# Altium schematic sheet DSG_Card_TopLevel.SchDoc
size B; Organization: Mechanart, LLC; Address1: 397 Laurie Meadows Drive; Address2: Apt. 437; Address3: San Mateo, CA 94403
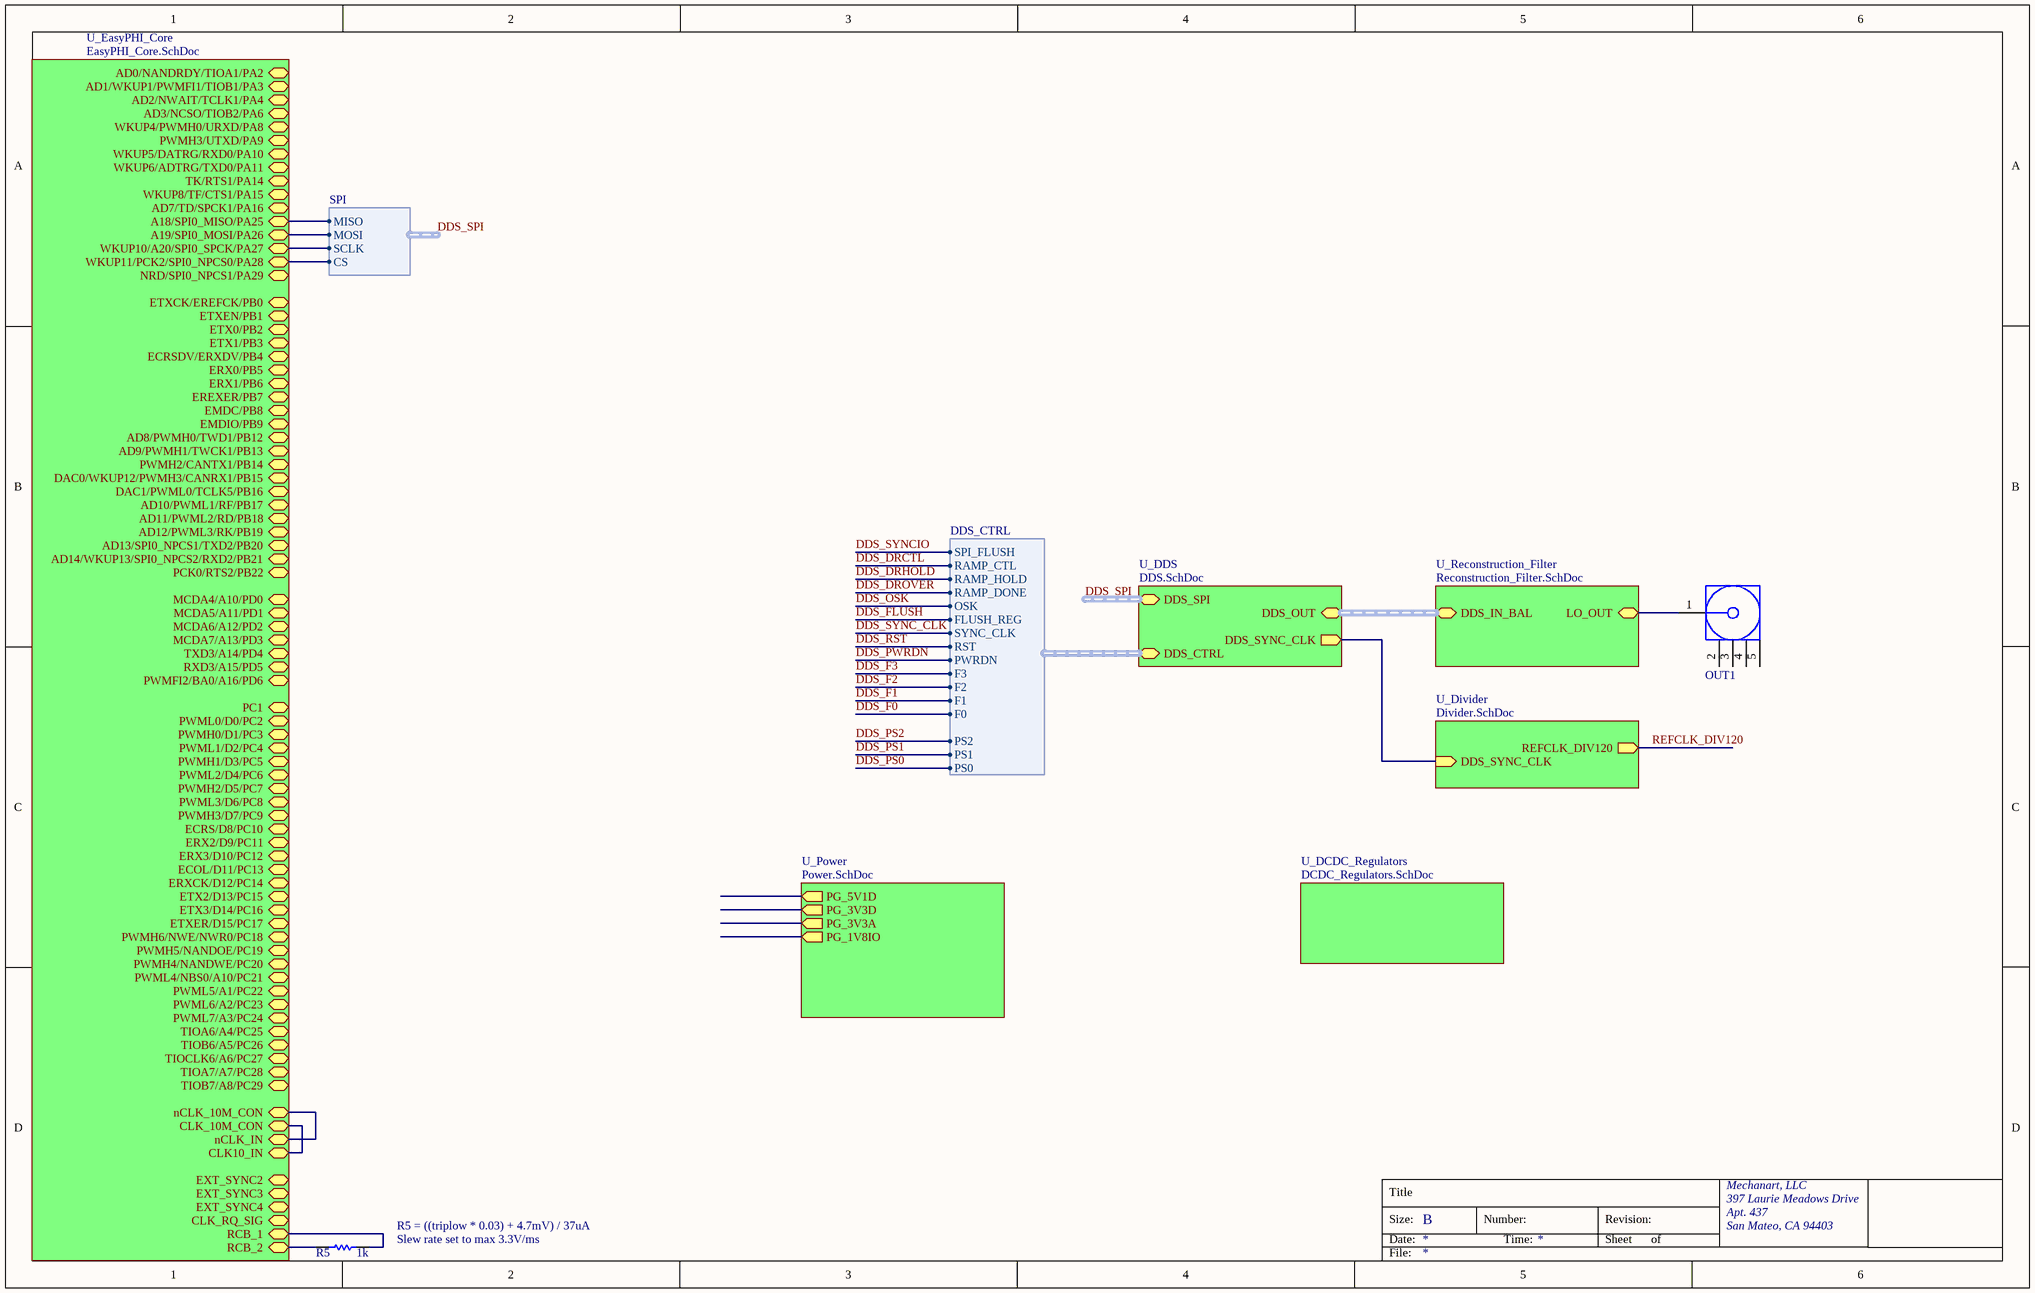
[diagram p0: DSG_Card_TopLevel.SchDoc]

## Parts
OUT1  SMA  [EMERSON_EDGE_062]  (value not drawn)
R5  1k  [RESC1608X45L30N]

## Sub-sheets
U_DCDC_Regulators = DCDC_Regulators.SchDoc: no entries
U_DDS = DDS.SchDoc: DDS_OUT (harness RF_BAL), DDS_CTRL (harness DDS_CTRL), DDS_SPI (harness SPI), DDS_SYNC_CLK (out)
U_Divider = Divider.SchDoc: REFCLK_DIV120 (out), DDS_SYNC_CLK (in)
U_EasyPHI_Core = EasyPHI_Core.SchDoc: AD0/NANDRDY/TIOA1/PA2, AD1/WKUP1/PWMFI1/TIOB1/PA3, AD2/NWAIT/TCLK1/PA4, AD3/NCSO/TIOB2/PA6, WKUP4/PWMH0/URXD/PA8, PWMH3/UTXD/PA9, WKUP5/DATRG/RXD0/PA10, WKUP6/ADTRG/TXD0/PA11, TK/RTS1/PA14, WKUP8/TF/CTS1/PA15, AD7/TD/SPCK1/PA16, A18/SPI0_MISO/PA25, A19/SPI0_MOSI/PA26, WKUP10/A20/SPI0_SPCK/PA27, WKUP11/PCK2/SPI0_NPCS0/PA28, NRD/SPI0_NPCS1/PA29, ETXCK/EREFCK/PB0, ETXEN/PB1, ETX0/PB2, ETX1/PB3, ECRSDV/ERXDV/PB4, ERX0/PB5, ERX1/PB6, EREXER/PB7, EMDC/PB8, EMDIO/PB9, AD8/PWMH0/TWD1/PB12, AD9/PWMH1/TWCK1/PB13, PWMH2/CANTX1/PB14, DAC0/WKUP12/PWMH3/CANRX1/PB15, DAC1/PWML0/TCLK5/PB16, AD10/PWML1/RF/PB17, AD11/PWML2/RD/PB18, AD12/PWML3/RK/PB19, AD13/SPI0_NPCS1/TXD2/PB20, AD14/WKUP13/SPI0_NPCS2/RXD2/PB21, PCK0/RTS2/PB22, MCDA4/A10/PD0, MCDA5/A11/PD1, MCDA6/A12/PD2, MCDA7/A13/PD3, TXD3/A14/PD4, RXD3/A15/PD5, PWMFI2/BA0/A16/PD6, PC1, PWML0/D0/PC2, PWMH0/D1/PC3, PWML1/D2/PC4, PWMH1/D3/PC5, PWML2/D4/PC6, PWMH2/D5/PC7, PWML3/D6/PC8, PWMH3/D7/PC9, ECRS/D8/PC10, ERX2/D9/PC11, ERX3/D10/PC12, ECOL/D11/PC13, ERXCK/D12/PC14, ETX2/D13/PC15, ETX3/D14/PC16, ETXER/D15/PC17, PWMH6/NWE/NWR0/PC18, PWMH5/NANDOE/PC19, PWML4/NBS0/A10/PC21, PWMH4/NANDWE/PC20, PWML5/A1/PC22, PWML6/A2/PC23, PWML7/A3/PC24, TIOA6/A4/PC25, TIOB6/A5/PC26, TIOCLK6/A6/PC27, TIOA7/A7/PC28, TIOB7/A8/PC29, nCLK_10M_CON, CLK_10M_CON, nCLK_IN, CLK10_IN, EXT_SYNC2, EXT_SYNC3, EXT_SYNC4, CLK_RQ_SIG, RCB_1, RCB_2
U_Power = Power.SchDoc: PG_5V1D (out), PG_3V3D (out), PG_3V3A (out), PG_1V8IO (out)
U_Reconstruction_Filter = Reconstruction_Filter.SchDoc: LO_OUT, DDS_IN_BAL (harness Harness)

## Harnesses
SPI: CS, MISO, MOSI, SCLK
DDS_CTRL: F0, F1, F2, F3, PS0, PS1, PS2, RST, PWRDN, SYNC_CLK, RAMP_CTL, RAMP_HOLD, RAMP_DONE, OSK, FLUSH_REG, SPI_FLUSH

## Nets
DDS_DRCTL: sheet U_DDS/DDS_CTRL.RAMP_CTL
DDS_DRHOLD: sheet U_DDS/DDS_CTRL.RAMP_HOLD
DDS_DROVER: sheet U_DDS/DDS_CTRL.RAMP_DONE
DDS_F0: sheet U_DDS/DDS_CTRL.F0
DDS_F1: sheet U_DDS/DDS_CTRL.F1
DDS_F2: sheet U_DDS/DDS_CTRL.F2
DDS_F3: sheet U_DDS/DDS_CTRL.F3
DDS_FLUSH: sheet U_DDS/DDS_CTRL.FLUSH_REG
DDS_OSK: sheet U_DDS/DDS_CTRL.OSK
DDS_PS0: sheet U_DDS/DDS_CTRL.PS0
DDS_PS1: sheet U_DDS/DDS_CTRL.PS1
DDS_PS2: sheet U_DDS/DDS_CTRL.PS2
DDS_PWRDN: sheet U_DDS/DDS_CTRL.PWRDN
DDS_RST: sheet U_DDS/DDS_CTRL.RST
DDS_SPI.CS: sheet U_EasyPHI_Core/WKUP11/PCK2/SPI0_NPCS0/PA28, sheet U_DDS/DDS_SPI.CS
DDS_SPI.MISO: sheet U_EasyPHI_Core/A18/SPI0_MISO/PA25, sheet U_DDS/DDS_SPI.MISO
DDS_SPI.MOSI: sheet U_EasyPHI_Core/A19/SPI0_MOSI/PA26, sheet U_DDS/DDS_SPI.MOSI
DDS_SPI.SCLK: sheet U_EasyPHI_Core/WKUP10/A20/SPI0_SPCK/PA27, sheet U_DDS/DDS_SPI.SCLK
DDS_SYNC_CLK: sheet U_DDS/DDS_CTRL.SYNC_CLK
DDS_SYNCIO: sheet U_DDS/DDS_CTRL.SPI_FLUSH
REFCLK_DIV120: sheet U_Divider/REFCLK_DIV120
NetOUT1_1: OUT1.1(Signal) ; sheet U_Reconstruction_Filter/LO_OUT
NetR5_1: R5.1 ; sheet U_EasyPHI_Core/RCB_1
NetR5_2: R5.2 ; sheet U_EasyPHI_Core/RCB_2
(unnamed): sheet U_DDS/DDS_SYNC_CLK, sheet U_Divider/DDS_SYNC_CLK
(unnamed): sheet U_EasyPHI_Core/nCLK_10M_CON, sheet U_EasyPHI_Core/nCLK_IN
(unnamed): sheet U_EasyPHI_Core/CLK_10M_CON, sheet U_EasyPHI_Core/CLK10_IN

Not connected (* = marked no-connect by the designer): OUT1 2(GND) 3(GND) 4(GND) 5(GND)

## Buses and harness runs
harness DDS_SPI = sheet U_DDS/DDS_SPI
harness sheet U_DDS/DDS_OUT = sheet U_Reconstruction_Filter/DDS_IN_BAL

## Notes on the sheet
- (near R5) R5 = ((triplow * 0.03) + 4.7mV) / 37uA
- (near R5) Slew rate set to max 3.3V/ms
- Title
- Size:
- Date:
- B
- Number:
- Time:
- Revision:
- Sheet
- of
- File:

## Library data of the parts
OUT1 = 142-0761-881: CONN SMA JACK 50 OHM EDGE MNT; Manufacturer: Cinch Connectivity Solutions Johnson; Connector Type: Jack, Female Socket; Contact Termination: Solder; Impedance: 50 Ohm; Frequency - Max: 26.5GHz; Body Material: Brass; Body Finish: Gold; Center Contact Material: Beryllium Copper; Dielectric Material: Polytetrafluoroethylene (PTFE); Voltage Rating: 170V; Design Item Id: 142-0761-881; Supplier 1: Digi-Key; Supplier Part Number 1: J801-ND; Manufacturer Part Number: 142-0761-881; RoHS: RoHS Compliant; Category: Connectors, Interconnects; Stock 1: 7776; Pricing 1: 1=12.1, 10=10.78, 50=8.8, 100=7.92, 250=7.26, 500=6.16, 750=5.852, 1000=5.5, 2500=5.28 (USD); Packaging: Bulk; Operating Temperature: -65°C ~ 165°C; Mounting Type: Board Edge, End Launch; ComponentLink1URL: http://cinchconnectivity.com/OA_MEDIA/drawings/dr-142-0761-881.pdf; ComponentLink1Description: http://cinchconnectivity.com/OA_MEDIA/drawings/dr-142-0761-881.pdf; Fastening Type: Threaded; Features: -; Connector Style: SMA; Shield Termination: Solder; Cable Group: -; Housing Color: Gold; Ingress Protection: -; Center Contact Plating: Gold
R5 = ERJ-3EKF1001V: RES SMD 1K OHM 1% 1/10W 0603; Manufacturer: Panasonic Electronic Components; Power (Watts): 0.1W, 1/10W; Temperature Coefficient: ±100ppm/°C; Resistance: 1k; Design Item Id: ERJ-3EKF1001V; Footprint: RESC_1608[0603]_N; Supplier 1: Digi-Key; Supplier Part Number 1: P1.00KHCT-ND; Manufacturer Part Number: ERJ-3EKF1001V; RoHS: RoHS Compliant; Category: Resistors; Stock 1: 7985279; Pricing 1: 1=0.1, 50=0.0114, 100=0.0084, 250=0.00644, 500=0.00514, 1000=0.00379 (USD); Packaging: Cut Tape (CT); Operating Temperature: -55°C ~ 155°C; Package / Case: 0603 (1608 Metric); Supplier Device Package: 0603; ComponentLink1URL: http://industrial.panasonic.com/www-cgi/jvcr13pz.cgi?E+PZ+3+AOA0002+ERJ3EKF1001V+7+WW; ComponentLink1Description: http://industrial.panasonic.com/www-cgi/jvcr13pz.cgi?E+PZ+3+AOA0002+ERJ3EKF1001V+7+WW; Tolerance: ±1%; Composition: Thick Film; Features: Automotive AEC-Q200; Size / Dimension: 0.063" L x 0.031" W (1.60mm x 0.80mm); Height: 0.022" (0.55mm); Number of Terminations: 2